# Altium schematic sheet ESP32S3.SchDoc
size A3; SheetNumber: 1; SheetTotal: 1
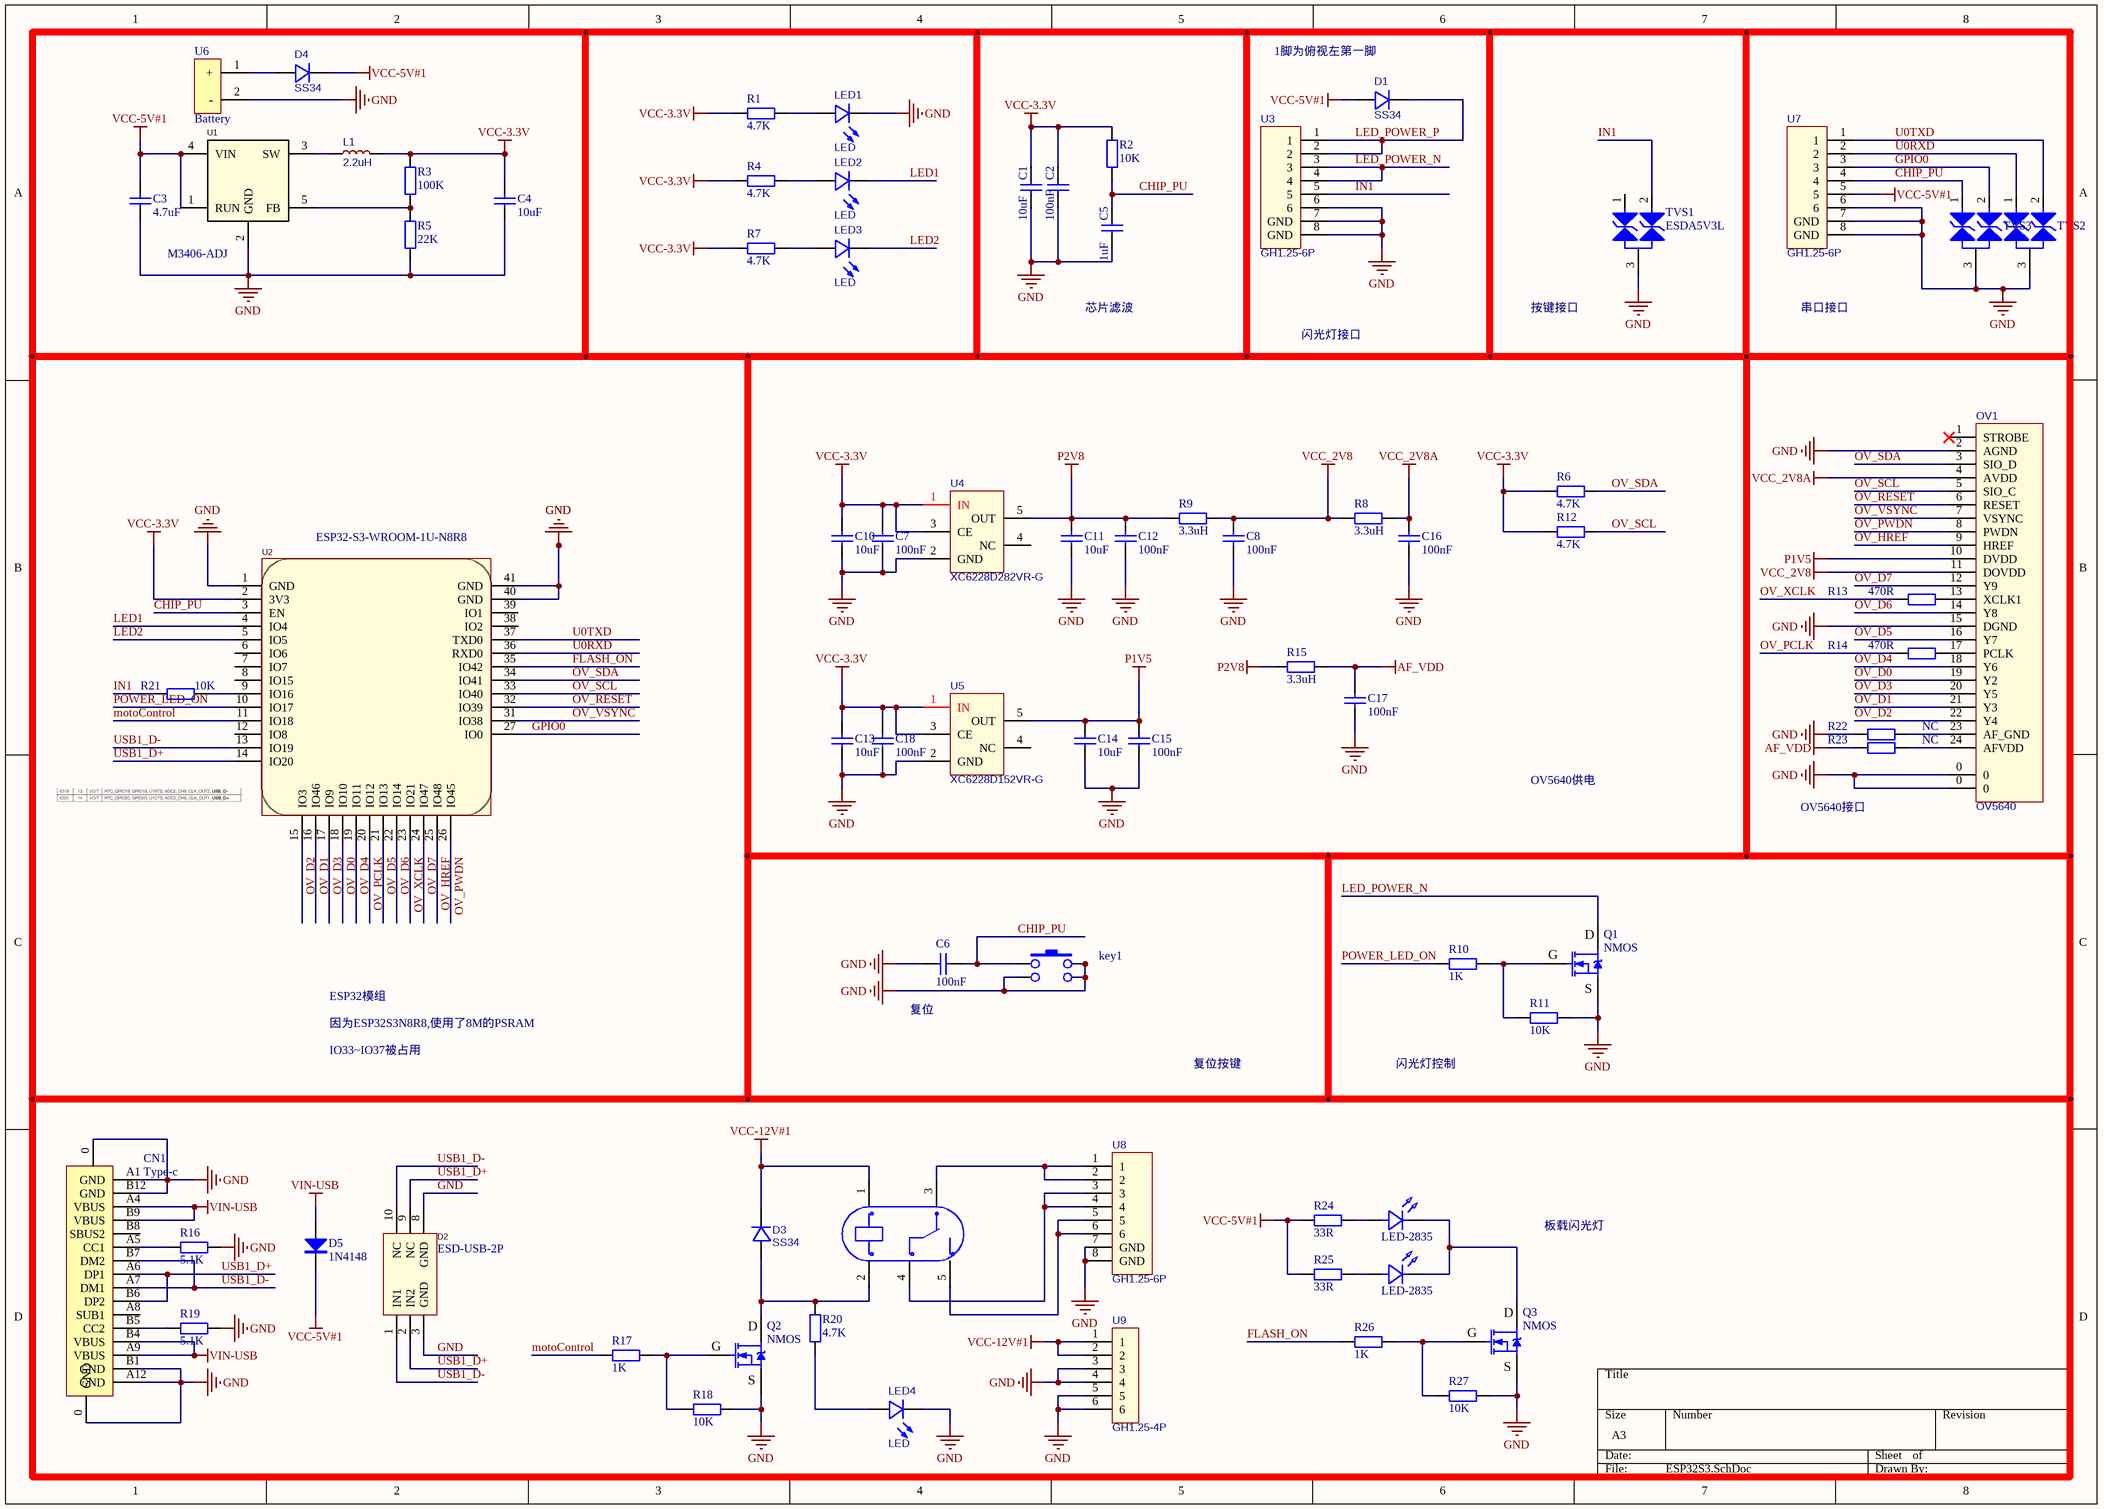
[diagram p0: ESP32S3.SchDoc]

## Parts
C1  10uF  [0603-C]
C2  100nF  [0603-C]
C3  4.7uF  [0603-C]
C4  10uF  [0603-C]
C5  1uF  [0603-C]
C6  100nF  [0603-C]
C7  100nF  [0603-C]
C8  100nF  [0603-C]
C10  10uF  [0603-C]
C11  10uF  [0603-C]
C12  100nF  [0603-C]
C13  10uF  [0603-C]
C14  10uF  [0603-C]
C15  100nF  [0603-C]
C16  100nF  [0603-C]
C17  100nF  [0603-C]
C18  100nF  [0603-C]
CN1  Type-c  [Type-c 16pin]
D1  SS34  [SS34-SMA]
D2  ESD-USB-2P  [SLP2510P8-2P]
D3  SS34  [SS34-SMA]
D4  SS34  [SS34-SMA]
D5  1N4148  [1N4148W]
K1  JQC-3FF/005-1ZS(551)  [RELAY-TH_HF3FF-XX-1ZXX-XXX]  (value not drawn)
key1  KEY  [轻触开关侧按3*6*3.5]  (value not drawn)
L1  2.2uH  [电感 4.2X4.4]
LED1  LED  [LED-0603]
LED2  LED  [LED-0603]
LED3  LED  [LED-0603]
LED4  LED  [LED-0603]
OV1  OV5640  [FPC-SMD_P0.50-24P_XJ-FGS]
Q1  NMOS  [AO3400]
Q2  NMOS  [AO3400]
Q3  NMOS  [AO3400]
R1  4.7K  [0603-R]
R2  10K  [0603-R]
R3  100K  [0603-R]
R4  4.7K  [0603-R]
R5  22K  [0603-R]
R6  4.7K  [0603-R]
R7  4.7K  [0603-R]
R8  3.3uH  [0603-R]
R9  3.3uH  [0603-R]
R10  1K  [0603-R]
R11  10K  [0603-R]
R12  4.7K  [0603-R]
R13  470R  [0603-R]
R14  470R  [0603-R]
R15  3.3uH  [0603-R]
R16  5.1K  [0603-R]
R17  1K  [0603-R]
R18  10K  [0603-R]
R19  5.1K  [0603-R]
R20  4.7K  [0603-R]
R21  10K  [0603-R]
R22  NC  [0603-R]
R23  NC  [0603-R]
R24  33R  [1206-R]
R25  33R  [1206-R]
R26  1K  [0603-R]
R27  10K  [0603-R]
TVS1  ESDA5V3L  [ESDA5V3L]
TVS2  ESDA5V3L  [ESDA5V3L]  (value not drawn)
TVS3  ESDA5V3L  [ESDA5V3L]  (value not drawn)
U1  M3406-ADJ  [M3406-ADJ]
U2  ESP32-S3-WROOM-1U-N8R8  [WIRELM-SMD_ESP32-S3-WROOM-1U]
U3  GH1.25-6P  [CONN-SMD_A1257WR-S-6P]
U4  XC6228D282VR-G  [XC6228D332VR-G]
U5  XC6228D152VR-G  [XC6228D332VR-G]
U6  Battery  [锂电池焊盘]
U7  GH1.25-6P  [CONN-SMD_A1257WR-S-6P]
U8  GH1.25-6P  [CONN-SMD_A1257WR-S-6P]
U9  GH1.25-4P  [CONN-SMD_GH1.25-4PWBPZ]
U10  LED-2835  [LED-SMD_L3.5-W2.8-FD-2835_WHITE]
U11  LED-2835  [LED-SMD_L3.5-W2.8-FD-2835_WHITE]

## Nets
AF_VDD: C17.2 R15.2 R23.2
GND: C1.1 C2.2 C3.1 C4.1 C5.2 C6.2 C7.1 C8.1 C10.1 C11.1 C12.1 C13.1 C14.1 C15.1 C16.1 C17.1 C18.1 CN1.0(GND) CN1.A1(GND) CN1.A12(GND) CN1.B1(GND) CN1.B12(GND) D2.3(GND) D2.8(GND) key1.2 key1.3 key1.4 LED1.1(-) LED4.1(-) OV1.0 OV1.2(AGND) OV1.15(DGND) Q1.2(S) Q2.2(S) Q3.2(S) R5.2 R11.1 R16.2 R18.1 R19.2 R22.2 R27.1 TVS1.3(K) TVS2.3(K) TVS3.3(K) U1.2(GND) U2.1(GND) U2.40(GND) U2.41(GND) U3.6 U3.7(GND) U3.8(GND) U4.2(GND) U5.2(GND) U6.2(-) U7.6 U7.7(GND) U7.8(GND) U8.7(GND) U8.8(GND) U9.3 U9.4 U9.5 U9.6
P1V5: C14.2 C15.2 OV1.10(DVDD) U5.5(OUT)
P2V8: C11.2 C12.2 R9.1 R15.1 U4.5(OUT)
VCC-3.3V: C1.2 C2.1 C4.2 C7.2 C10.2 C13.2 C18.2 L1.2 R1.1 R2.2 R3.2 R4.1 R6.2 R7.1 R12.2 U2.2(3V3) U4.1(IN) U4.3(CE) U5.1(IN) U5.3(CE)
VCC-5V#1: C3.2 D1.1(+) D4.2(-) D5.2(K) R24.2 R25.2 U1.1(RUN) U1.4(VIN) U7.5
VCC-12V#1: D3.2(-) K1.1 U9.1 U9.2
VCC_2V8: C8.2 OV1.11(DOVDD) R8.1 R9.2
VCC_2V8A: C16.2 OV1.4(AVDD) R8.2
VIN-USB: CN1.A4(VBUS) CN1.A9(VBUS) CN1.B4(VBUS) CN1.B9(VBUS) D5.1(A)
CHIP_PU: C5.1 C6.1 key1.1 R2.1 TVS3.1(K) U2.3(EN) U7.4
FLASH_ON: R26.2 U2.35(IO42)
GPIO0: TVS3.2(A) U2.27(IO0) U7.3
IN1: R21.2 TVS1.2(A) U3.5
LED1: LED2.1(-) U2.4(IO4)
LED2: LED3.1(-) U2.5(IO5)
LED_POWER_N: Q1.3(D) U3.3 U3.4
LED_POWER_P: D1.2(-) U3.1 U3.2
motoControl: R17.2 U2.11(IO18)
OV_D0: OV1.19(Y2) U2.18(IO10)
OV_D1: OV1.21(Y3) U2.16(IO46)
OV_D2: OV1.22(Y4) U2.15(IO3)
OV_D3: OV1.20(Y5) U2.17(IO9)
OV_D4: OV1.18(Y6) U2.19(IO11)
OV_D5: OV1.16(Y7) U2.21(IO13)
OV_D6: OV1.14(Y8) U2.22(IO14)
OV_D7: OV1.12(Y9) U2.24(IO47)
OV_HREF: OV1.9(HREF) U2.25(IO48)
OV_PCLK: R14.2 U2.20(IO12)
OV_PWDN: OV1.8(PWDN) U2.26(IO45)
OV_RESET: OV1.6(RESET) U2.32(IO39)
OV_SCL: OV1.5(SIO_C) R12.1 U2.33(IO40)
OV_SDA: OV1.3(SIO_D) R6.1 U2.34(IO41)
OV_VSYNC: OV1.7(VSYNC) U2.31(IO38)
OV_XCLK: R13.2 U2.23(IO21)
POWER_LED_ON: R10.2 U2.10(IO17)
U0RXD: TVS2.1(K) U2.36(RXD0) U7.2
U0TXD: TVS2.2(A) U2.37(TXD0) U7.1
USB1_D+: CN1.A6(DP1) CN1.B6(DP2) D2.2(IN2) D2.9(NC) U2.14(IO20)
USB1_D-: CN1.A7(DM1) CN1.B7(DM2) D2.1(IN1) D2.10(NC) U2.13(IO19)
NetCN1_A5: CN1.A5(CC1) R16.1
NetCN1_B5: CN1.B5(CC2) R19.1
NetD3_1: D3.1(+) K1.2 Q2.3(D) R20.1
NetD4_1: D4.1(+) U6.1(+)
NetK1_3: K1.3 U8.1 U8.2
NetK1_4: K1.4 U8.3 U8.4
NetK1_5: K1.5 U8.5 U8.6
NetL1_1: L1.1 U1.3(SW)
NetLED1_2: LED1.2(+) R1.2
NetLED2_2: LED2.2(+) R4.2
NetLED3_2: LED3.2(+) R7.2
NetLED4_2: LED4.2(+) R20.2
NetOV1_13: OV1.13(XCLK1) R13.1
NetOV1_17: OV1.17(PCLK) R14.1
NetOV1_23: OV1.23(AF_GND) R22.1
NetOV1_24: OV1.24(AFVDD) R23.1
NetQ1_1: Q1.1(G) R10.1 R11.2
NetQ2_1: Q2.1(G) R17.1 R18.2
NetQ3_1: Q3.1(G) R26.1 R27.2
NetQ3_3: Q3.3(D) U10.1(K) U11.1(K)
NetR3_1: R3.1 R5.1 U1.5(FB)
NetR21_1: R21.1 U2.9(IO16)
NetR24_1: R24.1 U10.2(A)
NetR25_1: R25.1 U11.2(A)

Not connected (* = marked no-connect by the designer): CN1 A8(SUB1) B8(SBUS2); OV1 1(STROBE)*; TVS1 1(K); U2 6(IO6) 7(IO7) 8(IO15) 12(IO8) 38(IO2) 39(IO1); U4 4(NC); U5 4(NC)

## Notes on the sheet
- 1脚为俯视左第一脚
- 芯片滤波
- 按键接口
- 串口接口
- 闪光灯接口
- OV5640供电
- OV5640接口
- 因为ESP32S3N8R8,使用了8M的PSRAM
- IO33~IO37被占用
- ESP32模组
- (near C6) 复位
- 复位按键
- 闪光灯控制
- 板载闪光灯

## Library data of the parts
C1-C8 C10-C18 = C: 贴片电容; BOM名称: 无极性贴片电容; 联系卖家，免费查找封装: 唯一出售店铺网址https://shop463601444.taobao.com
CN1 = Type-c: U262-161N-4BVC11
D1 D3 D4 = SS34: BOM_Manufacturer: Wuxi ARK Tech Elec; BOM_Manufacturer Part: D-G060306G1-KS2; Contributor: LCSC; BOM_Supplier: LCSC; BOM_Supplier Part: C118334; BOM_JLCPCB Part Class: Extended Part; spicePre: L; spiceSymbolName: D-G060306G1-KS2
D2 = ESD-USB-2P: RClamp0522PATCT; Manufacturer: SEMTECH; Name: RClamp0524PATCT; Device: RClamp0524PATCT_C40960; Add into BOM: yes; Reverse Stand-Off Voltage (Vrwm): 5V; Breakdown Voltage (VBR): 6V; Clamping Voltage@Ipp: 15V; Peak Pulse Power(Ppp)@8/20us: 150W; Junction Capacitance(Cj)@1MHz: 0.8pF@1MHz; Symbol: RClamp0524PATCT; LCSC Part Name: RClamp0524PATCT; Supplier Part: C40960; Manufacturer Part: RClamp0524PATCT; Supplier Footprint: SLP2510P8; JLCPCB Part Class: Extended Part; Datasheet: https://atta.szlcsc.com/upload/public/pdf/source/20150124/1457707260739.pdf; Supplier: LCSC; Convert to PCB: yes; Operating Temperature: -55℃~+125℃@(Tj)
D5 = 1N4148W: 整流二极管; 版权归属: 源创客; BOM名称: 整流二极管; 学习资源: www.ooocke.com
K1 = JQC-3FF/005-1ZS(551): Manufacturer: HF(宏发); Symbol: JQC-3FF/05-1ZS(551); Add into BOM: yes; Coil Voltage: 5V; Coil Type: 非极化-单线圈; Pin Number: 5; Contact Form: 一组转换:1C(单刀双掷-转换); Maximum Switching Current: 10A; Maximum Switching Voltage: 277V@AC；30V@DC; Coil Rated Power: 360mW; Contact Rating: 10A@28VDC；10A@277VAC; Coil Resistance: 70Ω; Operate Time: 10ms; Release Time: 5ms; Contact Resistance: 100mΩ; Name: JQC-3FF/005-1ZS(551); Device: JQC-3FF/005-1ZS(551); LCSC Part Name: 超小型大功率5V继电器 单刀双掷; Supplier Part: C9221; Manufacturer Part: JQC-3FF/005-1ZS(551); Supplier Footprint: 插件,15.5x19mm; JLCPCB Part Class: Extended Part; Datasheet: https://atta.szlcsc.com/upload/public/pdf/source/20210906/31FD0911648F640D4227475E890A46EB.pdf; Supplier: LCSC; Convert to PCB: yes; Contact Material: AgCdO; Operating Temperature: -40℃~+85℃
key1 = 轻触开关3*6*3.6
L1 = L: BOM_Manufacturer: Sunlord; BOM_Manufacturer Part: UPZ2012D800-4R0TF; nameAlias: Value; Contributor: LCSC; BOM_Supplier: LCSC; BOM_Supplier Part: C145060; BOM_JLCPCB Part Class: Extended Part; spicePre: L; spiceSymbolName: UPZ2012D800-4R0TF
LED1-LED4 = LED: BOM_Manufacturer: Wuxi ARK Tech Elec; BOM_Manufacturer Part: D-G060306G1-KS2; Contributor: LCSC; BOM_Supplier: LCSC; BOM_Supplier Part: C118334; BOM_JLCPCB Part Class: Extended Part; spicePre: L; spiceSymbolName: D-G060306G1-KS2
OV1 = OV5640: BOM_Manufacturer: Shenzhen Cankemeng; Contributor: LCSC; BOM_Supplier: LCSC; BOM_Supplier Part: C132514; BOM_Manufacturer Part: -; BOM_JLCPCB Part Class: Extended Part; spicePre: F; spiceSymbolName: FPC0.5-24P
Q1-Q3 = AO3400: N沟道 30V/4.2A; BOM名称: 场效应管; 联系卖家，免费查找封装: 唯一出售店铺网址https://shop463601444.taobao.com; 参数: N沟道 30V/4.2A
R1-R27 = R: 贴片电阻; 联系卖家，免费查找封装: 唯一出售店铺网址https://shop463601444.taobao.com; BOM名称: 贴片电阻
U1 = M3406-ADJ: Manufacturer: 西安航天民芯; Symbol: M3406; Add into BOM: yes; Function: 降压型; Name: M3406-ADJ; Device: M3406-ADJ; LCSC Part Name: 降压型; Supplier Part: C83224; Manufacturer Part: M3406-ADJ; Supplier Footprint: SOT-23-5; JLCPCB Part Class: Extended Part; Datasheet: https://atta.szlcsc.com/upload/public/pdf/source/20161110/1478742836232.pdf; Supplier: LCSC; Convert to PCB: yes; Synchronous Rectification: -; Number of Outputs: -; Topology: -; Input Voltage: -; Output Current (Max): -; Switching Frequency: -
U2 = ESP32-S3-WROOM-1U-N8R8: Manufacturer: ESPRESSIF(乐鑫); Add into BOM: yes; Name: ESP32-S3-WROOM-1U-N8; Symbol: ESP32-S3-WROOM-1U-N8; Device: ESP32-S3-WROOM-1U-N8; LCSC Part Name: ESP32-S3-WROOM-1U-N8; Supplier Part: C2980297; Manufacturer Part: ESP32-S3-WROOM-1U-N8; Supplier Footprint: SMD; JLCPCB Part Class: Extended Part; Datasheet: https://atta.szlcsc.com/upload/public/pdf/source/20220628/A2AC12B3C87735CAEB7EBE2DBE80936C.pdf; Supplier: LCSC; Convert to PCB: yes
U3 U7 U8 = GH1.25-6P: GH1.25-4PWBPZ; BOM_Manufacturer: BOOMELE(博穆精密); Contributor: LCSC; BOM_Supplier: LCSC; BOM_Supplier Part: C2829253; BOM_Manufacturer Part: GH1.25-4PWBPZ; spicePre: U; spiceSymbolName: GH1.25-4PWBPZ
U4 U5 = XC6228D282VR-G: 输出类型：固定 输出极性：正 输出通道数：1 最大输入电压：5.5V 输出电压：2.8V 压差：305mV@(300mA) 输出电流：300mA 电源纹波抑制比(PSRR)：80dB@(1kHz) 3.3V固定输出，Iout=300mA，Vin=5.5V(Max); BOM_Manufacturer: TOREX; BOM_Supplier: LCSC; BOM_Manufacturer Part: XC6228D332VR-G; BOM_Supplier Part: C69841; BOM_JLCPCB Part Class: Extended Part; spicePre: U; spiceSymbolName: XC6228D332VR-G
U9 = GH1.25-4P: GH1.25-4PWBPZ; BOM_Manufacturer: BOOMELE(博穆精密); Contributor: LCSC; BOM_Supplier: LCSC; BOM_Supplier Part: C2829253; BOM_Manufacturer Part: GH1.25-4PWBPZ; spicePre: U; spiceSymbolName: GH1.25-4PWBPZ
U10 U11 = LED-2835: Manufacturer: HONGLITRONIC(鸿利光电); Name: A2835W3H2-D01-8D2AB5; Add into BOM: yes; Symbol: A2835W3H2-D01-8D2AB5; Device: A2835W3H2-D01-8D2AB5; LCSC Part Name: 2835自然白3800-4250K 高性价比; Supplier Part: C7423445; Manufacturer Part: A2835W3H2-D01-8D2AB5; Supplier Footprint: 2835; JLCPCB Part Class: Extended Part; Datasheet: https://atta.szlcsc.com/upload/public/pdf/source/20230608/811871640B6DA35415197D15B0ECD5AB.pdf; Supplier: LCSC; Convert to PCB: yes